# Altium schematic sheet POWER.SchDoc
size A4
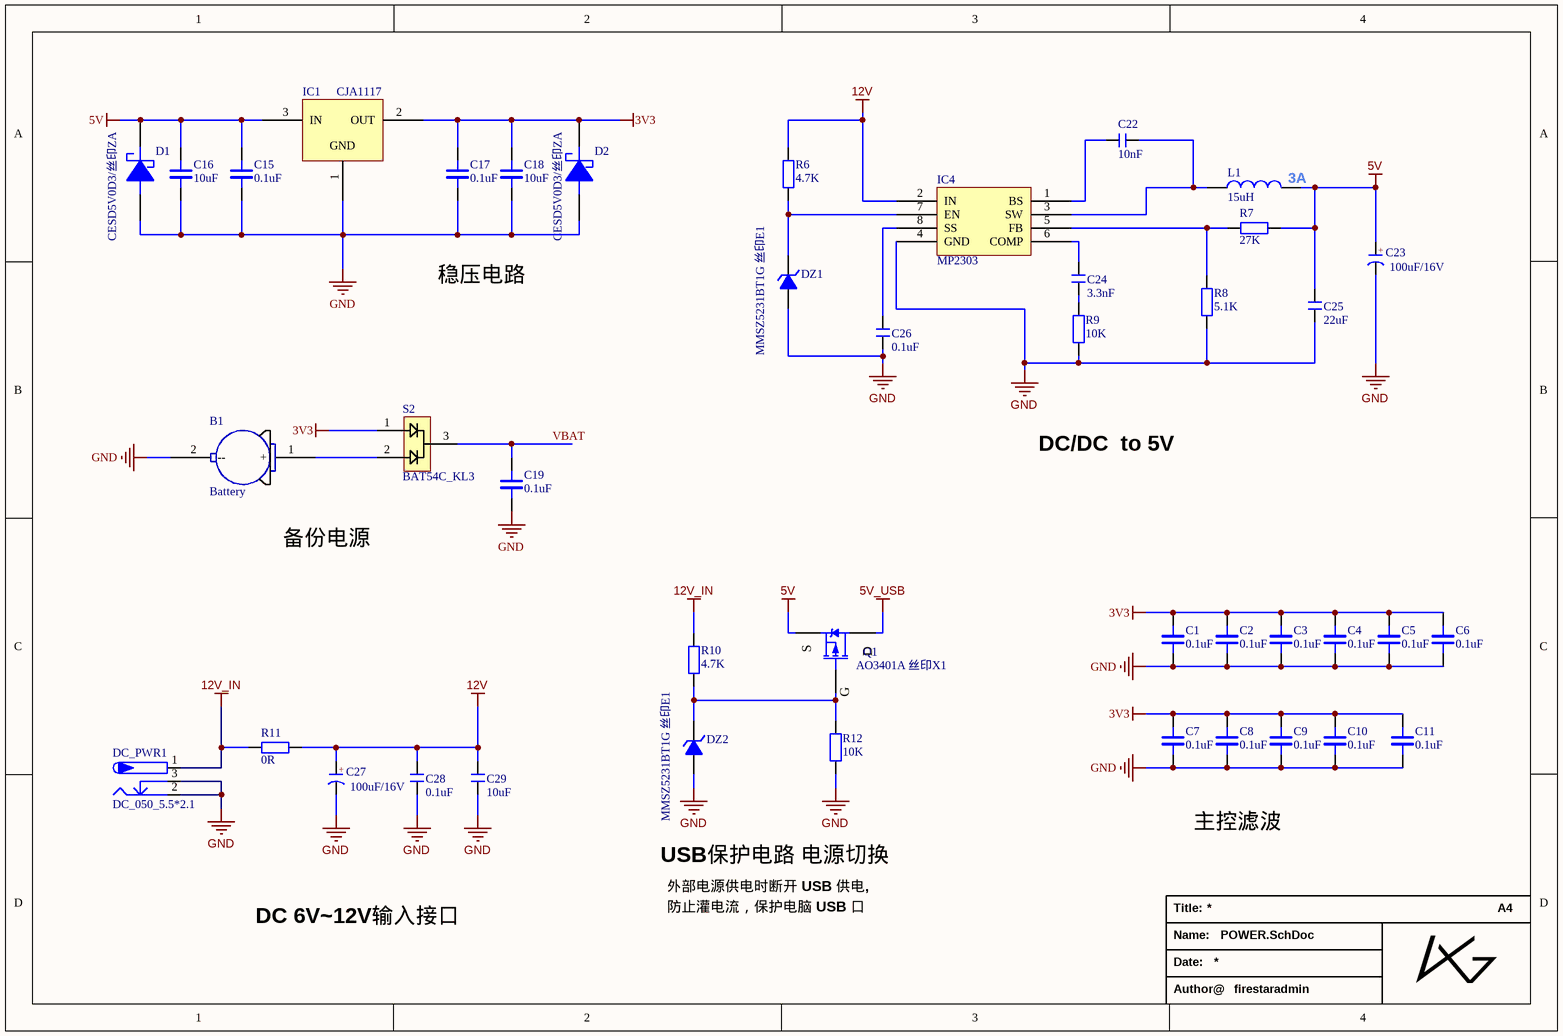
[diagram p0: POWER.SchDoc]

## Parts
B1  Battery  [CR1220_B]
C1  0.1uF  [C 0603_M]
C2  0.1uF  [C 0603_M]
C3  0.1uF  [C 0603_M]
C4  0.1uF  [C 0603_M]
C5  0.1uF  [C 0603_M]
C6  0.1uF  [C 0603_M]
C7  0.1uF  [C 0603_M]
C8  0.1uF  [C 0603_M]
C9  0.1uF  [C 0603_M]
C10  0.1uF  [C 0603_M]
C11  0.1uF  [C 0603_M]
C15  0.1uF  [C 0603_M]
C16  10uF  [C 0603_M]
C17  0.1uF  [C 0603_M]
C18  10uF  [C 0603_M]
C19  0.1uF  [C 0603_M]
C22  10nF  [C 0603_M]
C23  100uF/16V  [CM D(6.3*5.4)]
C24  3.3nF  [C 0603_M]
C25  22uF  [C 0603_M]
C26  0.1uF  [C 0603_M]
C27  100uF/16V  [CM D(6.3*5.4)]
C28  0.1uF  [C 0603_M]
C29  10uF  [C 0603_M]
D1  CESD5V0D3/丝印ZA  [SOD-323]
D2  CESD5V0D3/丝印ZA  [SOD-323]
DC_PWR1  DC_050_5.5*2.1  [DC-050]
DZ1  MMSZ5231BT1G 丝印E1  [SOD-123]
DZ2  MMSZ5231BT1G 丝印E1  [SOD-123]
IC1  CJA1117  [SOT89_M]
IC4  MP2303  [SOP8_M]
L1  15uH  [L-SMD-0630]
Q1  AO3401A 丝印X1  [SOT23-3M]
R6  4.7K  [R 0603_M]
R7  27K  [R 0603_M]
R8  5.1K  [R 0603_M]
R9  10K  [R 0603_M]
R10  4.7K  [R 0603_M]
R11  0R  [R 0603_M]
R12  10K  [R 0603_M]
S2  BAT54C_KL3  [SOT23-3M]

## Nets
3V3: C1.2 C2.2 C3.2 C4.2 C5.2 C6.2 C7.2 C8.2 C9.2 C10.2 C11.2 C17.1 C18.1 D2.2(-) IC1.2(OUT) S2.1
5V: C15.1 C16.1 C23.1(A) C25.2 D1.2(-) IC1.3(IN) L1.2 Q1.2(S) R7.1
5V_USB: Q1.3(D)
12V: C27.1(A) C28.2 C29.2 IC4.2(IN) R6.2 R11.2
12V_IN: DC_PWR1.1 R10.2 R11.1
GND: B1.2(--) C1.1 C2.1 C3.1 C4.1 C5.1 C6.1 C7.1 C8.1 C9.1 C10.1 C11.1 C15.2 C16.2 C17.2 C18.2 C19.2 C23.2(K) C25.1 C26.1 C27.2(K) C28.1 C29.1 D1.1(+) D2.1(+) DC_PWR1.2 DC_PWR1.3 DZ1.1(A) DZ2.1(A) IC1.1(GND) IC4.4(GND) R8.1 R9.1 R12.1
VBAT: C19.1 S2.3
NetB1_1: B1.1(+) S2.2
NetC22_1: C22.1 IC4.3(SW) L1.1
NetC22_2: C22.2 IC4.1(BS)
NetC24_1: C24.1 R9.2
NetC24_2: C24.2 IC4.6(COMP)
NetC26_2: C26.2 IC4.8(SS)
NetDZ1_2: DZ1.2(K) IC4.7(EN) R6.1
NetDZ2_2: DZ2.2(K) Q1.1(G) R10.1 R12.2
NetIC4_5: IC4.5(FB) R7.2 R8.2

## Notes on the sheet
- (near L1) 3A
- 稳压电路
- DC/DC  to 5V
- 备份电源
- 主控滤波
- DC 6V~12V输入接口
- USB保护电路 电源切换
- 外部电源供电时断开 USB 供电,
- 防止灌电流，保护电脑 USB 口
- Title:
- A4
- Name:
- Date:
- Author@
- firestaradmin
- (in symbol C-CM) +

## Library data of the parts
C1-C11 C15-C19 = CAP: Capacitor
C22 C24-C26 C28 C29 = C: 无极性贴片电容; 版权归属: 源创客; BOM名称: 无极性贴片电容; 学习资源: www.ooocke.com
C23 C27 = C-CM: 贴片电解电容; 版权归属: 源创客; BOM名称: 贴片电解电容; 学习资源: www.ooocke.com
D1 D2 = TVS
DC_PWR1 = P-DC: 低压电源接口; BOM名称: DC电源接口; 版权归属: 源创客; 学习资源: www.ooocke.com
DZ1 DZ2 = 1N4625: 5.1V/0.5W稳压管; 版权归属: 源创客; BOM名称: 5.1V/0.5W稳压管; 学习资源: www.ooocke.com
L1 = L: 小功率贴片电感; 版权归属: 源创客; BOM名称: 小功率贴片电感; 学习资源: www.ooocke.com
Q1 = SI2301: P沟道场效应管; 版权归属: 源创客; BOM名称: P沟道场效应管; 学习资源: www.ooocke.com
R6-R12 = R: 贴片电阻; 版权归属: 源创客; BOM名称: 贴片电阻; 学习资源: www.ooocke.com